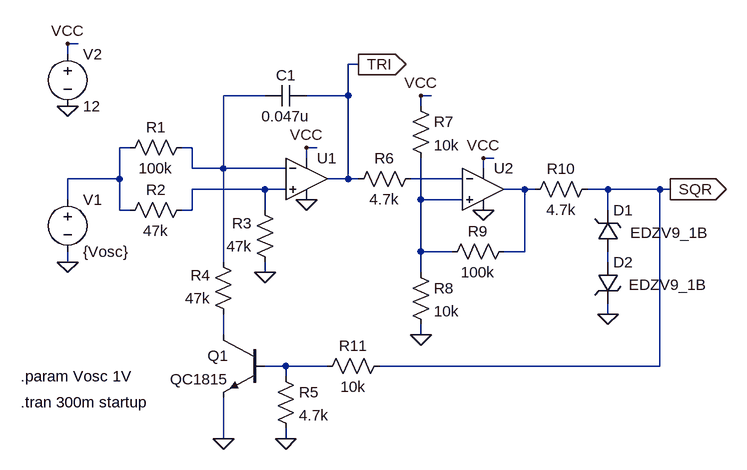
[diagram p0: schematic VCO_Tri_Sqr.asc]
VCO_Tri_Sqr.asc, the LTspice schematic file:
Version 4
SHEET 1 1064 680
WIRE 32 -96 16 -96
WIRE 16 -80 16 -96
WIRE 464 -64 448 -64
WIRE 320 -16 256 -16
WIRE 448 -16 448 -64
WIRE 448 -16 384 -16
WIRE 576 -16 560 -16
WIRE 560 0 560 -16
WIRE 112 64 96 64
WIRE 208 64 192 64
WIRE 400 64 384 64
WIRE 384 80 384 64
WIRE 672 80 656 80
WIRE 208 96 208 64
WIRE 256 96 256 -16
WIRE 256 96 208 96
WIRE 352 96 256 96
WIRE 656 96 656 80
WIRE 96 112 96 64
WIRE 96 112 16 112
WIRE 448 112 448 -16
WIRE 448 112 416 112
WIRE 464 112 448 112
WIRE 624 112 544 112
WIRE 320 128 208 128
WIRE 352 128 320 128
WIRE 720 128 688 128
WIRE 736 128 720 128
WIRE 848 128 816 128
WIRE 928 128 848 128
WIRE 944 128 928 128
WIRE 16 144 16 112
WIRE 560 144 560 80
WIRE 624 144 560 144
WIRE 96 160 96 112
WIRE 112 160 96 160
WIRE 208 160 208 128
WIRE 208 160 192 160
WIRE 320 160 320 128
WIRE 848 160 848 128
WIRE 560 224 560 144
WIRE 608 224 560 224
WIRE 720 224 720 128
WIRE 720 224 688 224
WIRE 16 240 16 224
WIRE 256 240 256 96
WIRE 848 240 848 224
WIRE 320 256 320 240
WIRE 560 256 560 224
WIRE 848 320 848 304
WIRE 256 352 256 320
WIRE 560 352 560 336
WIRE 352 400 320 400
WIRE 416 400 352 400
WIRE 928 400 928 128
WIRE 928 400 496 400
WIRE 352 416 352 400
WIRE 256 512 256 448
WIRE 352 512 352 496
FLAG 384 64 VCC
FLAG 384 144 0
FLAG 256 512 0
FLAG 320 256 0
FLAG 352 512 0
FLAG 560 -16 VCC
FLAG 656 160 0
FLAG 656 80 VCC
FLAG 560 352 0
FLAG 848 320 0
FLAG 16 240 0
FLAG 16 0 0
FLAG 16 -96 VCC
FLAG 944 128 SQR
IOPIN 944 128 Out
FLAG 464 -64 TRI
IOPIN 464 -64 Out
SYMBOL Opamps\\UniversalOpamp2 384 112 R0
SYMATTR InstName U1
SYMBOL voltage 16 128 R0
WINDOW 123 0 0 Left 2
WINDOW 39 0 0 Left 2
SYMATTR InstName V1
SYMATTR Value {Vosc}
SYMBOL res 208 48 R90
WINDOW 0 0 56 VBottom 2
WINDOW 3 32 56 VTop 2
SYMATTR InstName R1
SYMATTR Value 100k
SYMBOL res 208 144 R90
WINDOW 0 0 56 VBottom 2
WINDOW 3 32 56 VTop 2
SYMATTR InstName R2
SYMATTR Value 47k
SYMBOL res 336 256 R180
WINDOW 0 36 76 Left 2
WINDOW 3 36 40 Left 2
SYMATTR InstName R3
SYMATTR Value 47k
SYMBOL res 272 336 R180
WINDOW 0 36 76 Left 2
WINDOW 3 36 40 Left 2
SYMATTR InstName R4
SYMATTR Value 47k
SYMBOL cap 384 -32 R90
WINDOW 0 0 32 VBottom 2
WINDOW 3 32 32 VTop 2
SYMATTR InstName C1
SYMATTR Value 0.047u
SYMBOL npn 320 352 M0
SYMATTR InstName Q1
SYMATTR Value QC1815
SYMBOL res 336 400 R0
SYMATTR InstName R5
SYMATTR Value 4.7k
SYMBOL Opamps\\UniversalOpamp2 656 128 R0
SYMATTR InstName U2
SYMBOL res 560 96 R90
WINDOW 0 0 56 VBottom 2
WINDOW 3 32 56 VTop 2
SYMATTR InstName R6
SYMATTR Value 4.7k
SYMBOL res 544 -16 R0
SYMATTR InstName R7
SYMATTR Value 10k
SYMBOL res 544 240 R0
SYMATTR InstName R8
SYMATTR Value 10k
SYMBOL res 704 208 R90
WINDOW 0 0 56 VBottom 2
WINDOW 3 32 56 VTop 2
SYMATTR InstName R9
SYMATTR Value 100k
SYMBOL res 832 112 R90
WINDOW 0 0 56 VBottom 2
WINDOW 3 32 56 VTop 2
SYMATTR InstName R10
SYMATTR Value 4.7k
SYMBOL zener 832 224 M180
WINDOW 0 24 64 Left 2
WINDOW 3 50 29 Left 2
SYMATTR InstName D1
SYMATTR Value EDZV9_1B
SYMBOL zener 832 240 R0
WINDOW 3 48 35 Left 2
SYMATTR Value EDZV9_1B
SYMATTR InstName D2
SYMBOL res 512 384 R90
WINDOW 0 0 56 VBottom 2
WINDOW 3 32 56 VTop 2
SYMATTR InstName R11
SYMATTR Value 10k
SYMBOL voltage 16 -96 R0
WINDOW 123 0 0 Left 2
WINDOW 39 0 0 Left 2
SYMATTR InstName V2
SYMATTR Value 12
TEXT -56 416 Left 2 !.param Vosc 1V
TEXT -56 456 Left 2 !.tran 300m startup

The netlist it stands for:
* VCO_Tri_Sqr.asc
XU1 N004 N001 VCC 0 TRI level.2 Avol=1Meg GBW=10Meg Slew=10Meg ilimit=25m rail=0 Vos=0 phimargin=45 en=0 enk=0 in=0 ink=0 Rin=500Meg  ; pins IN+ IN- V+ V- OUT
V1 N002 0 {Vosc}
R1 N001 N002 100k
R2 N004 N002 47k
R3 0 N004 47k
R4 N008 N001 47k
C1 TRI N001 0.047u
Q1 N008 N009 0 0 QC1815
R5 N009 0 4.7k
XU2 N006 N003 VCC 0 N005 level.2 Avol=1Meg GBW=10Meg Slew=10Meg ilimit=25m rail=0 Vos=0 phimargin=45 en=0 enk=0 in=0 ink=0 Rin=500Meg  ; pins IN+ IN- V+ V- OUT
R6 N003 TRI 4.7k
R7 VCC N006 10k
R8 N006 0 10k
R9 N005 N006 100k
R10 SQR N005 4.7k
D1 N007 SQR EDZV9_1B
D2 N007 0 EDZV9_1B
R11 SQR N009 10k
V2 VCC 0 12
.model D D
.lib standard.dio
.model NPN NPN
.model PNP PNP
.lib standard.bjt
.param Vosc 1V
.tran 300m startup
.lib UniversalOpamps2.sub
.backanno
.end